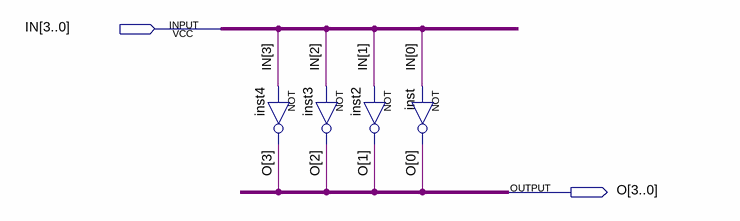
[diagram p0: schematic sheet]
// Quartus schematic Inversor4Bists.bdf as structural Verilog: 4 symbols, 2 pins
module Inversor4Bists (
  input  [3:0] IN,
  output [3:0] O
);

  not inst4 (O[3], IN[3]);
  not inst3 (O[2], IN[2]);
  not inst2 (O[1], IN[1]);
  not inst (O[0], IN[0]);
endmodule
